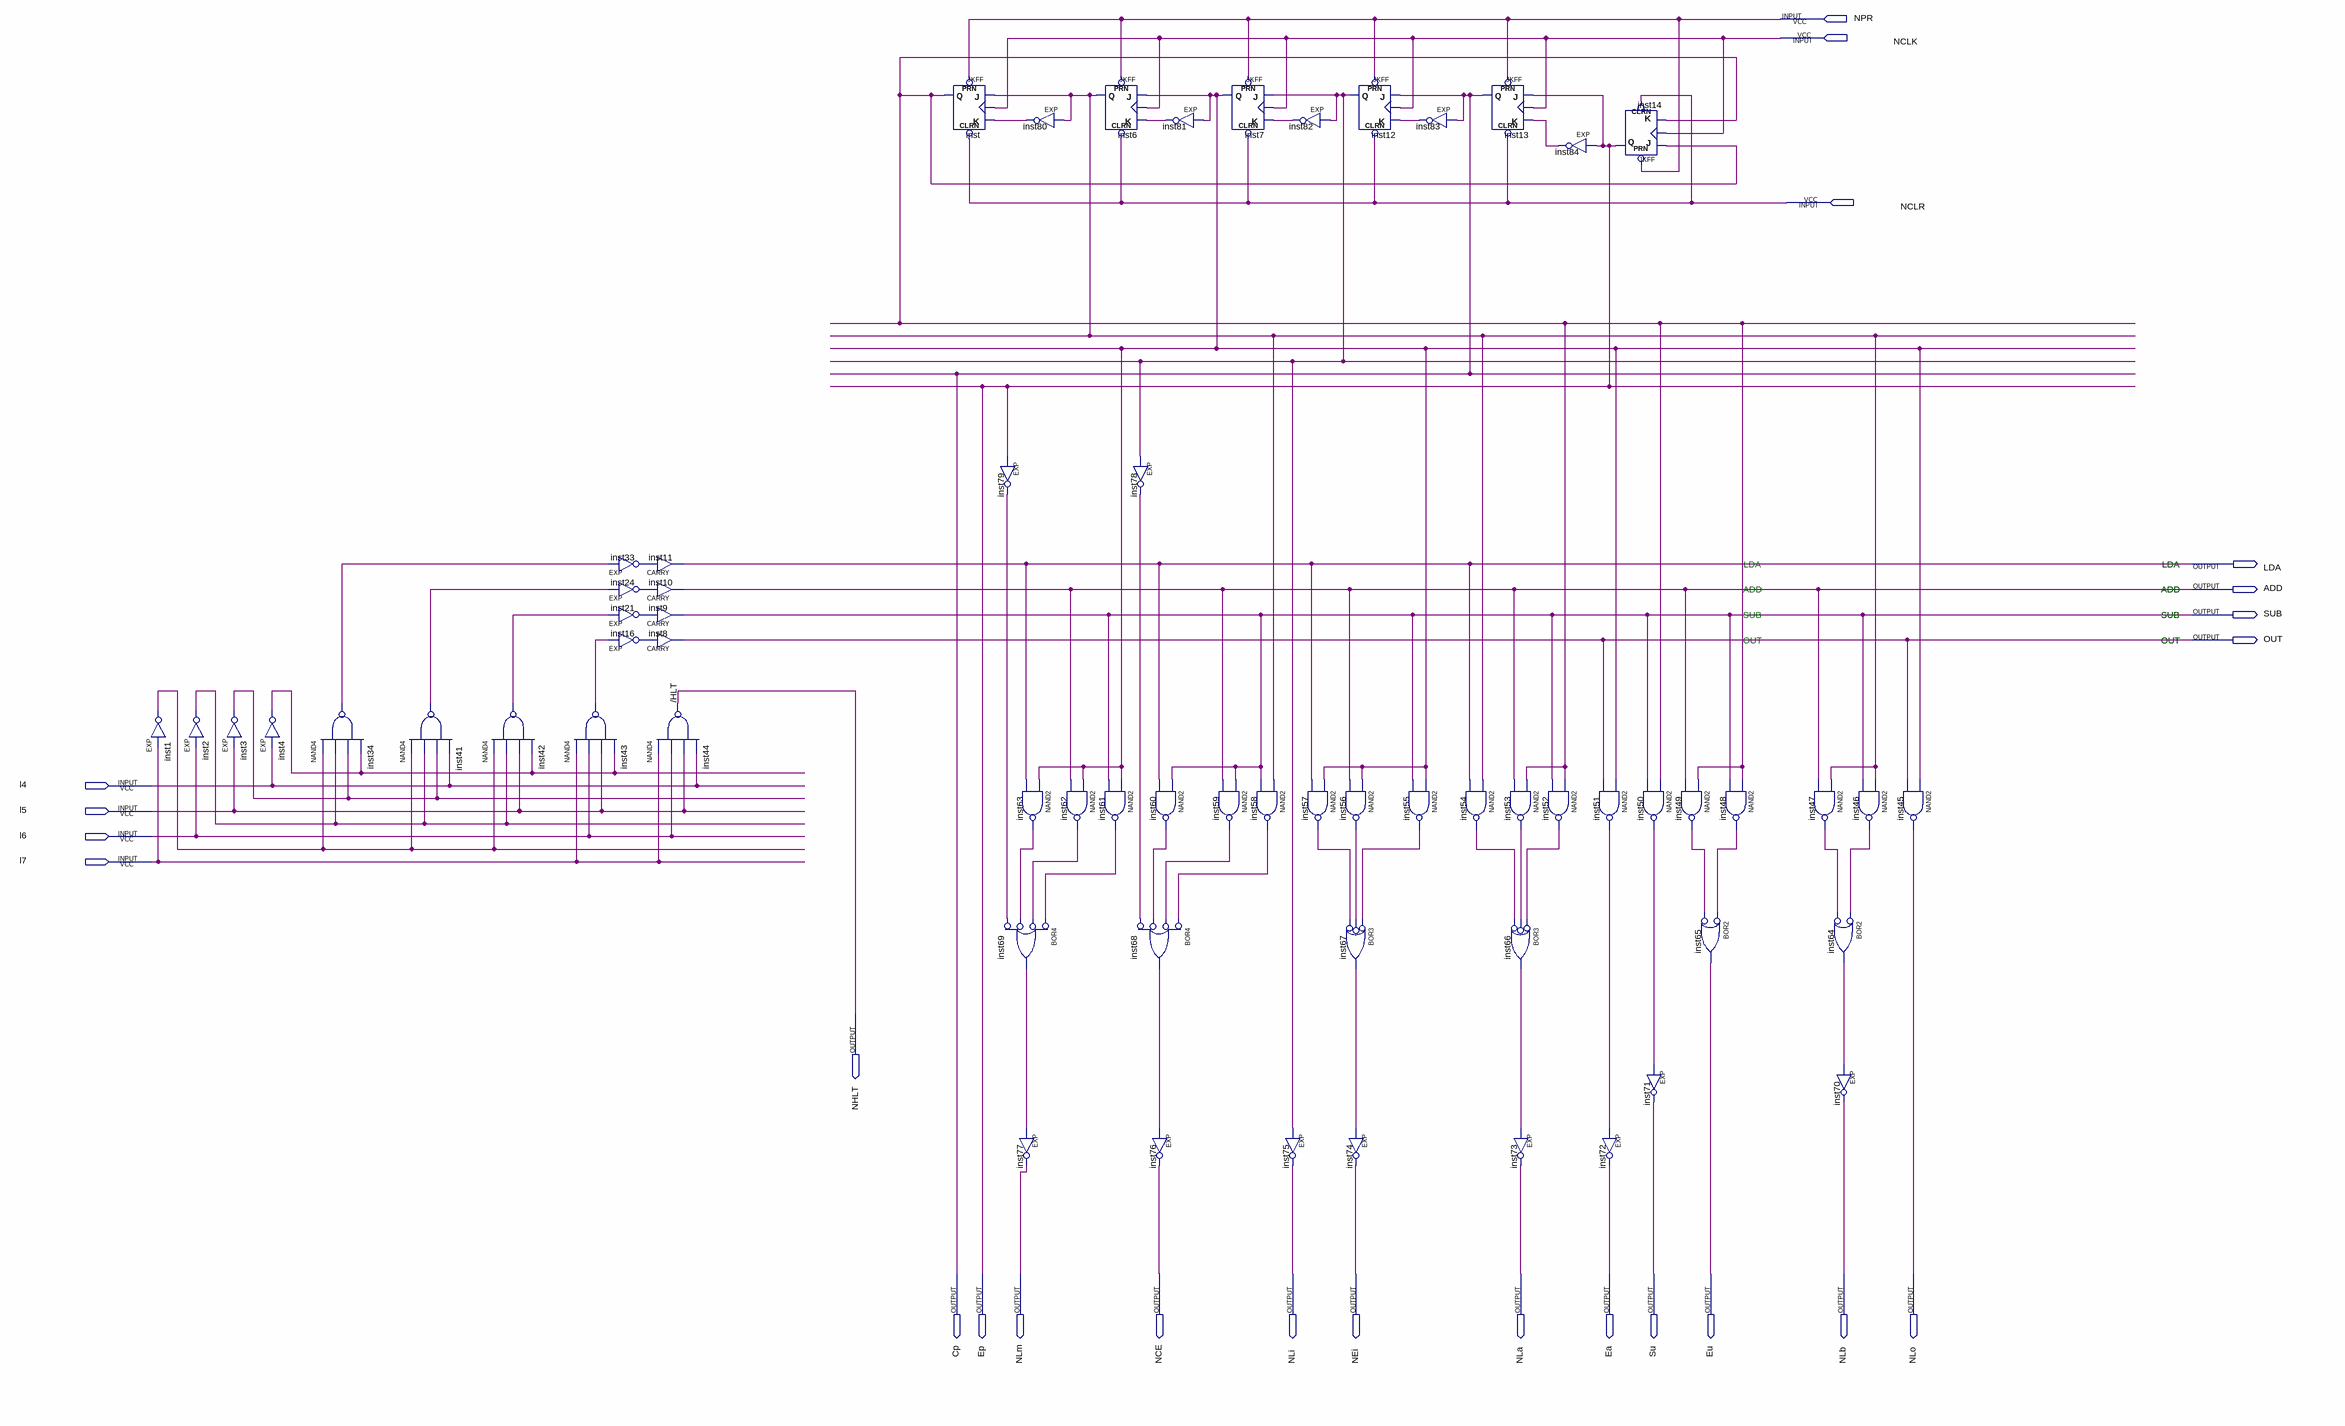
[diagram p0: schematic sheet]
// Quartus schematic DecInst_Cont_CtrlMtr.bdf as structural Verilog: 63 symbols, 24 pins
module DecInst_Cont_CtrlMtr (
  input  NPR,
  input  NCLK,
  input  NCLR,
  input  l4,
  input  l5,
  input  l6,
  input  l7,
  output LDA,
  output ADD,
  output SUB,
  output OUT,
  output NHLT,
  output Cp,
  output Ep,
  output NLm,
  output NCE,
  output NLi,
  output NEi,
  output NLa,
  output Ea,
  output Su,
  output Eu,
  output NLb,
  output NLo
);

  wire inst1_out, inst2_out, inst3_out, inst4_out, inst6_q, inst7_q, inst12_q, inst16_out, inst21_out,
       inst24_out, inst33_out, inst34_out, inst41_out, inst42_out, inst43_out, inst46_out, inst47_out,
       inst48_out, inst49_out, inst50_out, inst51_out, inst52_out, inst53_out, inst54_out, inst55_out,
       inst56_out, inst57_out, inst58_out, inst59_out, inst60_out, inst61_out, inst62_out, inst63_out,
       inst64_out, inst66_out, inst67_out, inst68_out, inst69_out, inst78_out, inst79_out, inst80_out,
       inst81_out, inst82_out, inst83_out, inst84_out, inst_q;

  EXP inst1 (.IN(l7), .OUT(inst1_out));
  EXP inst2 (.IN(l6), .OUT(inst2_out));
  EXP inst3 (.IN(l5), .OUT(inst3_out));
  EXP inst4 (.IN(l4), .OUT(inst4_out));
  nand inst34 (inst34_out, inst1_out, inst2_out, inst3_out, inst4_out);
  nand inst41 (inst41_out, inst1_out, inst2_out, inst3_out, l4);
  nand inst42 (inst42_out, inst1_out, inst2_out, l5, inst4_out);
  nand inst43 (inst43_out, l7, l6, l5, inst4_out);
  EXP inst33 (.IN(inst34_out), .OUT(inst33_out));
  EXP inst24 (.IN(inst41_out), .OUT(inst24_out));
  EXP inst21 (.IN(inst42_out), .OUT(inst21_out));
  EXP inst16 (.IN(inst43_out), .OUT(inst16_out));
  CARRY inst11 (.IN(inst33_out), .OUT(LDA));
  CARRY inst10 (.IN(inst24_out), .OUT(ADD));
  CARRY inst9 (.IN(inst21_out), .OUT(SUB));
  CARRY inst8 (.IN(inst16_out), .OUT(OUT));
  nand inst44 (NHLT, l7, l6, l5, l4);
  JKFF inst (.PRN(NPR), .CLRN(NCLR), .K(inst80_out), .J(inst6_q), .CLK(NCLK), .Q(inst_q));
  EXP inst79 (.IN(Ep), .OUT(inst79_out));
  nand inst63 (inst63_out, inst7_q, LDA);
  or inst69 (inst69_out, ~inst61_out, ~inst62_out, ~inst63_out, ~inst79_out);  // BOR4
  EXP inst77 (.IN(inst69_out), .OUT(NLm));
  EXP inst80 (.IN(inst6_q), .OUT(inst80_out));
  nand inst62 (inst62_out, inst7_q, ADD);
  JKFF inst6 (.PRN(NPR), .CLRN(NCLR), .K(inst81_out), .J(inst7_q), .CLK(NCLK), .Q(inst6_q));
  nand inst61 (inst61_out, inst7_q, SUB);
  EXP inst81 (.IN(inst7_q), .OUT(inst81_out));
  EXP inst78 (.IN(inst12_q), .OUT(inst78_out));
  nand inst60 (inst60_out, SUB, LDA);
  or inst68 (inst68_out, ~inst58_out, ~inst59_out, ~inst60_out, ~inst78_out);  // BOR4
  EXP inst76 (.IN(inst68_out), .OUT(NCE));
  JKFF inst7 (.PRN(NPR), .CLRN(NCLR), .K(inst82_out), .J(inst12_q), .CLK(NCLK), .Q(inst7_q));
  nand inst59 (inst59_out, SUB, ADD);
  nand inst58 (inst58_out, inst6_q, SUB);
  EXP inst82 (.IN(inst12_q), .OUT(inst82_out));
  nand inst57 (inst57_out, inst7_q, LDA);
  EXP inst75 (.IN(inst12_q), .OUT(NLi));
  JKFF inst12 (.PRN(NPR), .CLRN(NCLR), .K(inst83_out), .J(Cp), .CLK(NCLK), .Q(inst12_q));
  nand inst56 (inst56_out, inst7_q, ADD);
  or inst67 (inst67_out, ~inst55_out, ~inst56_out, ~inst57_out);  // BOR3
  EXP inst74 (.IN(inst67_out), .OUT(NEi));
  EXP inst83 (.IN(Cp), .OUT(inst83_out));
  nand inst55 (inst55_out, inst7_q, SUB);
  nand inst54 (inst54_out, inst6_q, LDA);
  JKFF inst13 (.PRN(NPR), .CLRN(NCLR), .K(inst84_out), .J(Ep), .CLK(NCLK), .Q(Cp));
  nand inst53 (inst53_out, inst_q, ADD);
  or inst66 (inst66_out, ~inst52_out, ~inst53_out, ~inst54_out);  // BOR3
  EXP inst73 (.IN(inst66_out), .OUT(NLa));
  EXP inst84 (.IN(Ep), .OUT(inst84_out));
  nand inst52 (inst52_out, inst_q, SUB);
  JKFF inst14 (.PRN(NPR), .CLRN(NCLR), .K(inst_q), .J(inst_q), .CLK(NCLK), .Q(Ep));
  nand inst51 (inst51_out, inst7_q, OUT);
  EXP inst72 (.IN(inst51_out), .OUT(Ea));
  nand inst49 (inst49_out, inst_q, ADD);
  nand inst50 (inst50_out, inst_q, SUB);
  EXP inst71 (.IN(inst50_out), .OUT(Su));
  nand inst48 (inst48_out, inst_q, SUB);
  or inst65 (Eu, ~inst48_out, ~inst49_out);  // BOR2
  nand inst47 (inst47_out, inst6_q, ADD);
  or inst64 (inst64_out, ~inst46_out, ~inst47_out);  // BOR2
  EXP inst70 (.IN(inst64_out), .OUT(NLb));
  nand inst46 (inst46_out, inst6_q, SUB);
  nand inst45 (NLo, inst7_q, OUT);

  // Other names for the same wires on the sheet: /HLT = NHLT

  // Notes on the sheet:
  //   LDA
  //   LDA
  //   ADD
  //   ADD
  //   SUB
  //   SUB
  //   OUT
  //   OUT
endmodule
